# EAGLE design LRSN v1 (EAGLE 9.5.0)
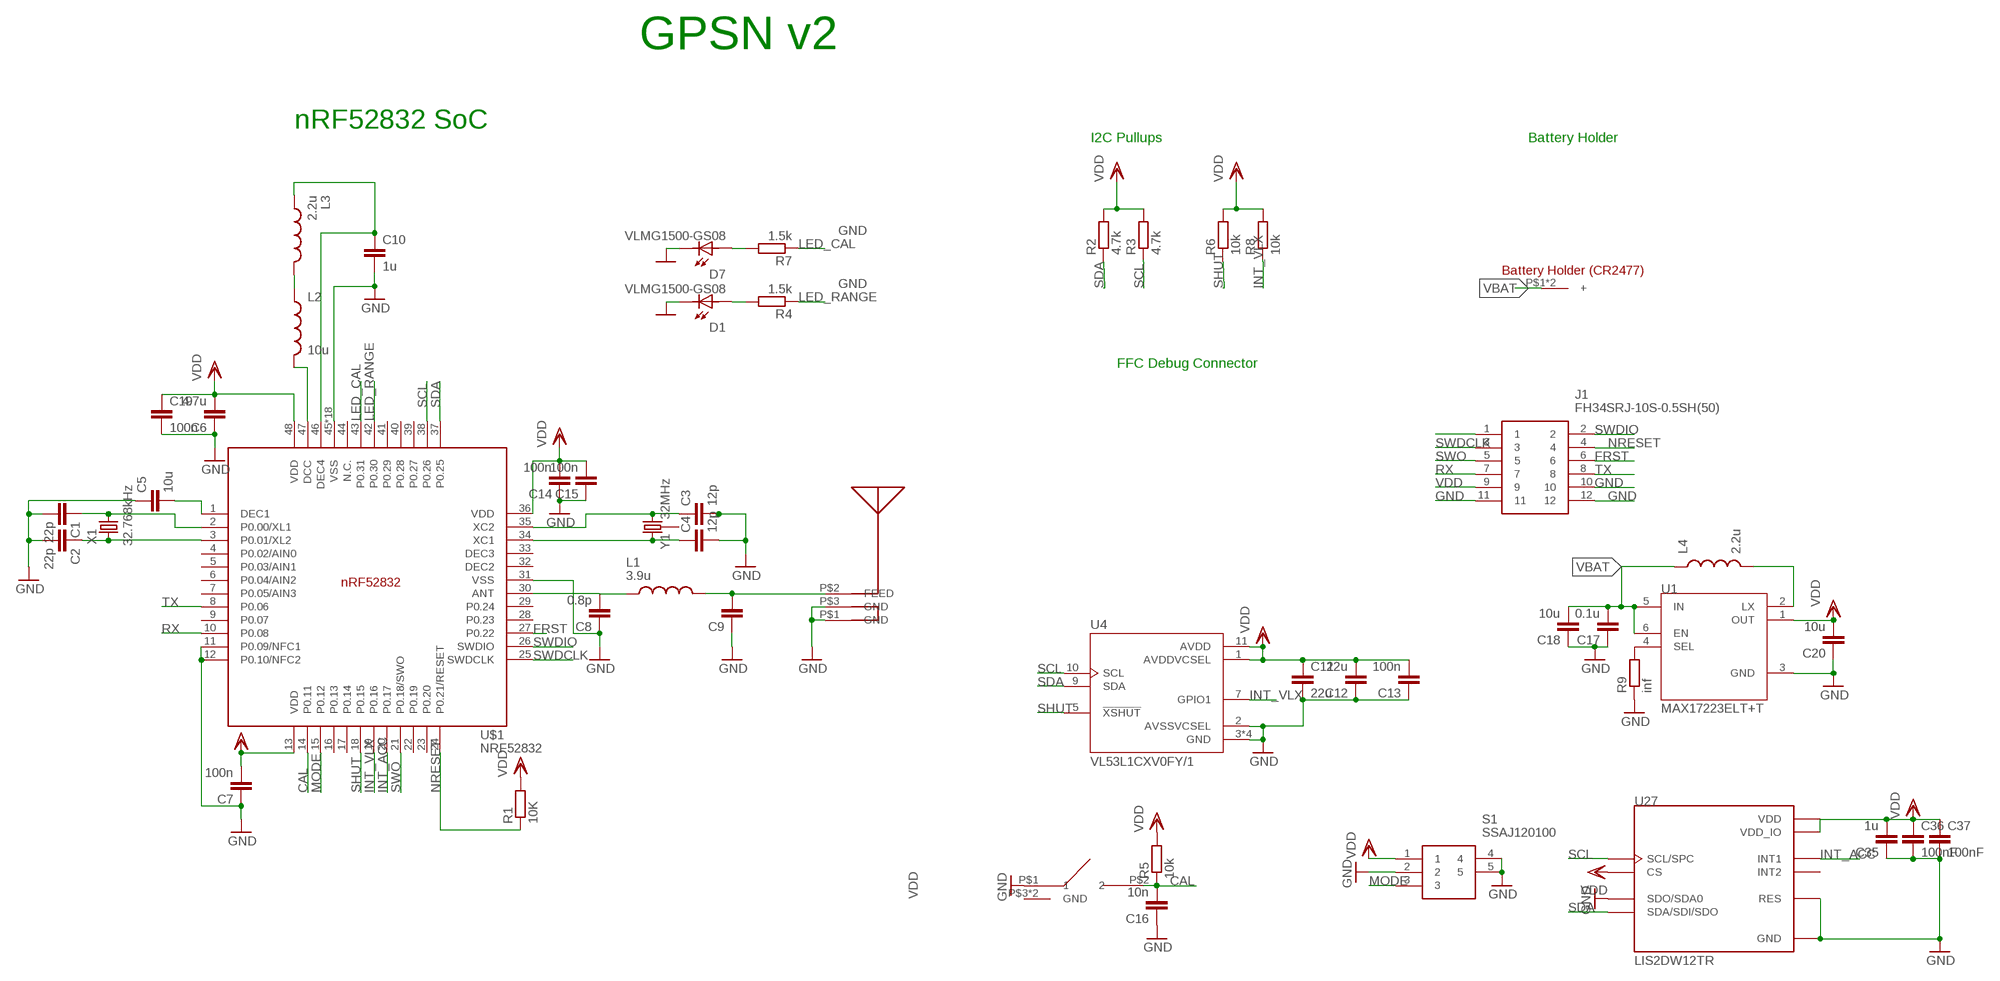
[diagram p0: schematic, sheet 1]

## Parts
C1  22p  CC0402  [C0402]
C2  22p  CC0402  [C0402]
C3  12p  CC0402  [C0402]
C4  12p  CC0402  [C0402]
C5  10u  CC0402  [C0402]
C6  4.7u  CC0402  [C0402]
C7  100n  CC0603R  [C0603R]
C8  0.8p  CC0402  [C0402]
C9  1.2p  CC0402  [C0402]
C10  1u  CC0402  [C0402]
C11  22u  CC0603R  [C0603R]
C12  22u  CC0603R  [C0603R]
C13  100n  CC0402  [C0402]
C14  100n  CC0402  [C0402]
C15  100n  CC0402  [C0402]
C16  10n  CC0402  [C0402]
C17  0.1u  CC0402  [C0402]
C18  10u  CC0402  [C0402]
C19  100n  CC0402  [C0402]
C20  10u  CC0402  [C0402]
C35  1u  CC0603R  [C0603R]
C36  100nF  CC0402  [C0402]
C37  100nF  CC0402  [C0402]
D1  VLMG1500-GS08  [LEDC1005X35N]
D7  VLMG1500-GS08  [LEDC1005X35N]
J1  FH34SRJ-10S-0.5SH(50)  [FH34SRJ10S05SH50]
L1  3.9u  MHQ0402P7N5JT000  [INDC0402X26N]
L2  10u  INDUCTOR  [L0603]
L3  2.2u  MHQ0402P7N5JT000  [INDC0402X26N]
L4  2.2u  INDUCTOR  [L0603]
R1  10K  RR0402  [R0402]
R2  4.7k  RR0402  [R0402]
R3  4.7k  RR0402  [R0402]
R4  1.5k  RR0402  [R0402]
R5  10k  RR0402  [R0402]
R6  10k  RR0402  [R0402]
R7  1.5k  RR0402  [R0402]
R8  10k  RR0402  [R0402]
R9  inf  RR0402  [R0402]
S1  SSAJ120100  [SSAJ120100]
U1  MAX17223ELT+T  [PSON65P200X200X80-6N]
U4  VL53L1CXV0FY/1  [SENSOR_VL53L1CXV0FY/1]
U27  LIS2DW12TR  [LGA12R50P4X4_200X200X70]
U$1  NRF52832  [QFN40P600X600X90-48_N]
U$3  T1C2QR  [T1C2QR]
U$4  CHIPANTENNAL2  [CHIPANTENNAL2]
VBAT  CR2477HOLDER  [CR2477HOLDER]
X1  32.768kHz  ABS07-32.768KHZ-T  [ABS07-32.768KHZ-T]
Y1  32MHz  CRYSTAL-26MHZSMD-3.2X2.5  [CRYSTAL-SMD-3.2X2.5MM]

## Nets
CAL: C16.2 R5.1 U$1.14(P0.11) U$3.P$2
FRST: J1.6 U$1.27(P0.22)
GND: C1.2 C2.2 C3.2 C4.2 C5.1 C6.1 C7.1 C8.1 C9.1 C10.2 C11.2 C12.1 C13.1 C14.1 C15.1 C16.1 C17.1 C18.1 C19.2 C20.1 C35.1 C36.2 C37.2 D1.2 D7.2 J1.10 J1.11 J1.12 R9.1 S1.2 S1.4 S1.5 U1.3(GND) U4.2(AVSSVCSEL) U4.3(GND) U4.4(GND) U4.6(GND) U4.12(GND) U27.3(SDO/SDA0) U27.6(GND) U27.7(RES) U27.8(GND) U$1.11(P0.09/NFC1) U$1.12(P0.10/NFC2) U$1.31(VSS) U$1.45(VSS) U$1.PAD(VSS) U$1.PAD@VIA01(VSS) U$1.PAD@VIA02(VSS) U$1.PAD@VIA03(VSS) U$1.PAD@VIA04(VSS) U$1.PAD@VIA05(VSS) U$1.PAD@VIA06(VSS) U$1.PAD@VIA07(VSS) U$1.PAD@VIA08(VSS) U$1.PAD@VIA09(VSS) U$1.PAD@VIA10(VSS) U$1.PAD@VIA11(VSS) U$1.PAD@VIA12(VSS) U$1.PAD@VIA13(VSS) U$1.PAD@VIA14(VSS) U$1.PAD@VIA15(VSS) U$1.PAD@VIA16(VSS) U$3.P$1 U$4.P$1(GND) U$4.P$3(GND)
INT_ACC: U27.12(INT1) U$1.20(P0.17)
INT_VLX: R8.1 U4.7(GPIO1) U$1.19(P0.16)
LED_CAL: R7.1 U$1.43(P0.31)
LED_RANGE: R4.1 U$1.42(P0.30)
MODE: S1.3 U$1.15(P0.12)
N$1: C1.1 U$1.2(P0.00/XL1) X1.2
N$2: C2.1 U$1.3(P0.01/XL2) X1.1
N$3: C3.1 U$1.35(XC2) Y1.3
N$4: C4.1 U$1.34(XC1) Y1.1
N$5: C5.2 U$1.1(DEC1)
N$6: C8.2 L1.1 U$1.30(ANT)
N$7: D1.1 R4.2
N$8: R9.2 U1.4(SEL)
N$9: L2.2 U$1.47(DCC)
N$10: L2.1 L3.2
N$11: C10.1 L3.1 U$1.46(DEC4)
N$13: L4.2 U1.2(LX)
N$17: J1.1
N$19: D7.1 R7.2
NRESET: J1.4 R1.1 U$1.24(P0.21/RESET)
RF: C9.2 L1.2 U$4.P$2(FEED)
RX: J1.7 U$1.10(P0.08)
SCL: R3.1 U4.10(SCL) U27.1(SCL/SPC) U$1.38(P0.26)
SDA: R2.1 U4.9(SDA) U27.4(SDA/SDI/SDO) U$1.37(P0.25)
SHUT: R6.1 U4.5(!XSHUT) U$1.18(P0.15)
SWDCLK: J1.3 U$1.25(SWDCLK)
SWDIO: J1.2 U$1.26(SWDIO)
SWO: J1.5 U$1.21(P0.18/SWO)
TX: J1.8 U$1.8(P0.06)
VBAT: C17.2 C18.2 L4.1 U1.5(IN) U1.6(EN) VBAT.P$1(+) VBAT.P$2(+)
VDD: C6.2 C7.2 C11.1 C12.2 C13.2 C14.2 C15.2 C19.1 C20.2 C35.2 C36.1 C37.1 J1.9 R1.2 R2.2 R3.2 R5.2 R6.2 R8.2 S1.1 U1.1(OUT) U4.1(AVDDVCSEL) U4.11(AVDD) U27.2(CS) U27.9(VDD) U27.10(VDD_IO) U$1.13(VDD) U$1.36(VDD) U$1.48(VDD)
Unconnected: U27.11(INT2) U$1.4(P0.02/AIN0) U$1.5(P0.03/AIN1) U$1.6(P0.04/AIN2) U$1.7(P0.05/AIN3) U$1.9(P0.07) U$1.16(P0.13) U$1.17(P0.14) U$1.22(P0.19) U$1.23(P0.20) U$1.28(P0.23) U$1.29(P0.24) U$1.32(DEC2) U$1.33(DEC3) U$1.39(P0.27) U$1.40(P0.28) U$1.41(P0.29) U$1.44(N.C.) U$3.P$3(GND) U$3.P$4(GND) Y1.2 Y1.4

## Notes on the sheet
- GPSN v2
- nRF52832 SoC
- I2C Pullups | Battery Holder
- FFC Debug Connector

## Library data of the parts
C1-C6 C8-C10 C13-C20 C36 C37 = eagle-ltspice:C: CAPACITOR, European symbol; SPICEMODEL: NONE; SPICEPREFIX: C
C7 C11 C12 C35 = eagle-ltspice:C: CAPACITOR, European symbol
D1 D7 = VLMG1500-GS08:VLMG1500-GS08: 0402 GREEN 571nm 35MCD 65° Rectangle with Flat Top SMT LED; AVAILABILITY: Unavailable; DESCRIPTION: 0402 GREEN 571nm 35MCD 65° Rectangle with Flat Top SMT LED; MF: Vishay; MP: VLMG1500-GS08; PACKAGE: 0402 Vishay; PRICE: None
J1 = FH34SRJ-10S-0.5SH_50_:FH34SRJ-10S-0.5SH(50): HIROSE(HRS) - FH34SRJ-10S-0.5SH(50) - CONNECTOR, FFC/FPC, RCPT, 10POS, 1ROW Source: Datasheet <https://www.hirose.com/product/en/products/FH34SRJ/FH34SRJ-10S-0.5SH(50)/> Check prices <https://pricing.snapeda.com/search/part/FH34SRJ-10S-0.5SH%2850%29/?ref=eda>; AVAILABILITY: Good; DESCRIPTION: FFC & FPC Connectors 10POS 0.50MM R/A CONN FFC FPC; MF: Hirose Connector; MP: FH34SRJ-10S-0.5SH(50); PACKAGE: None; PRICE: None; PURCHASE-URL: https://pricing.snapeda.com/search/part/FH34SRJ-10S-0.5SH(50)/?ref=eda
L1 L3 = MHQ0402P7N5JT000:MHQ0402P7N5JT000: 221 NH 5% GOLD TERMINAL; AVAILABILITY: Unavailable; DESCRIPTION: FIXED IND 7.5NH 200MA 1.2 OHM; MF: TDK; MP: MHQ0402P7N5JT000; PACKAGE: 0402 TDK; PRICE: None
L2 L4 = BeagleBone_Blue_R3:INDUCTOR: Inductors Basic Inductor/Choke - 0603 and 1206. Footprints are not proven and vary greatly between part numbers. SRN6045- 33uH, 20% 1.4A
R1-R9 = eagle-ltspice:R: RESISTOR, European symbol; SPICEMODEL: NONE; SPICEPREFIX: R
S1 = SSAJ120100:SSAJ120100: Slide Switches 1-pole 2-positions Surface Mount Slide Switch SPDT Maintained 10 mA Slide Source: Datasheet <https://componentsearchengine.com/Datasheets/1/SSAJ120100.pdf> Check prices <https://pricing.snapeda.com/search/part/SSAJ120100/?ref=eda>; AVAILABILITY: Good; DESCRIPTION: Switch Slide SPDT Raised Slide 0.01A 5VDC 10000Cycle Gull Wing SMD T/R; MF: ALPS; MP: SSAJ120100; PACKAGE: None; PRICE: None; PURCHASE-URL: https://pricing.snapeda.com/search/part/SSAJ120100/?ref=eda
U1 = MAX17223ELT_T:MAX17223ELT+T: Conv DC-DC Single Step Up 0.4V to 5.5V 6-Pin uDFN T/R Check prices <https://pricing.snapeda.com/parts/MAX17223ELT%2B/Maxim%20Integrated/view-part?ref=eda>; AVAILABILITY: Bad; DESCRIPTION: Boost Switching Regulator IC Positive Adjustable 1.8V 1 Output 500mA (Switch) 6-WDFN; MF: Maxim Integrated; MP: MAX17223ELT+; PACKAGE: uDFN-6 Maxim; PRICE: None
U4 = VL53L1:VL53L1CXV0FY/1: ToF Proximity 4m Distance Check prices <https://pricing.snapeda.com/search/part/VL53L1CXV0FY/1/?ref=eda>; AVAILABILITY: Good; DESCRIPTION: Optical Sensor 157.480 (4m) I²C Output; MF: STMicroelectronics; MP: VL53L1CXV0FY/1; PACKAGE: LGA-12 STMicroelectronics; PRICE: None; PURCHASE-URL: https://pricing.snapeda.com/search/part/VL53L1CXV0FY/1/?ref=eda
U27 = LIS2DW12TR:LIS2DW12TR: Mems Digital Output Motion Sensor Check prices <https://pricing.snapeda.com/parts/LIS2DW12TR/STMicroelectronics/view-part?ref=eda>; AVAILABILITY: Good; DESCRIPTION: Accelerometer X, Y, Z Axis ±2g, 4g, 8g, 16g 400Hz 12-LGA (2x2); MF: STMicroelectronics; MP: LIS2DW12TR; PACKAGE: LGA-12 STMicroelectronics; PRICE: None; PURCHASE-URL: https://pricing.snapeda.com/search/part/LIS2DW12TR/?ref=eda
U$1 = Nordic_nRF:NRF52832: nRF52832 Features Single chip, highly flexible, 2.4 GHz multi-protocol SoC 32-bit ARM Cortex-M4F Processor 1.7v to 3.6v operation 512kB flash + 64kB RAM Supports concurrent Bluetooth Smart/ANT protocol operation On-chip NFC tag for Out-of-Band (OOB) pairing Up to +4dBm output power -96dBm sensitivity, Bluetooth Smart Thread safe and run-time protected Event driven API On air compatible with nRF24L and nRF24AP series 2 data rates (2Mbps/1Mbps) PPI - maximum flexibility for power-efficient applications and code simplification Automated power management system with automatic power management of each peripheral Configurable I/O mapping for analog and digital I/O 3 x Master/Slave SPI 2 x Two-wire interface (I²C) UART (RTS/CTS) 3 x PWM AES HW encryption Real Time Counter (RTC) Digital microphone interface (PDM) On-chip balun Applications Internet of Things (IoT) Wearables SmartHome sensors Connected white goods Computer peripherals Voice-command smart remotes A4WP ‘Rezence’ wireless charging Beacons Sports and fitness sensors and hubs Connected health products Smart watches RC Toys Interactive games Building automation and sensor networks
U$3 = T1C2QR:T1C2QR
U$4 = CHIPANTENNA:CHIPANTENNAL2
VBAT = CR2477 holder:CR2477HOLDER
X1 = Crystals:ABS07-32.768KHZ-T: CRYSTAL 32.7680KHZ 12.5PF SMD Manufacturer's datasheet <https://abracon.com/Resonators/ABS07.pdf>; CREATED_BY: PCBLayout.com; DIGIKEY_PART_NUMBER: 535-9542-2-ND; MANUFACTURER: Abracon LLC; MPN: ABS07-32.768KHZ-T; PACKAGE: SMD-2
Y1 = SparkFun-Clocks:CRYSTAL-26MHZ: 26MHz Crystal w/ Ground Pin Digikey Example <http://www.digikey.com/product-detail/en/epson/TSX-3225%2026.0000MF09Z-AC3/SER3627CT-ND/1802878> Frequency: 26MHz Frequency Stability: ±9ppm Frequency Tolerance: ±10ppm Load Capacitance: 9pF SparkFun Products: SparkFun ESP32 Thing <https://www.sparkfun.com/products/13907> SparkFun ESP8266 Thing Dev Board <https://www.sparkfun.com/products/13711>; PROD_ID: XTAL-12454

## Board
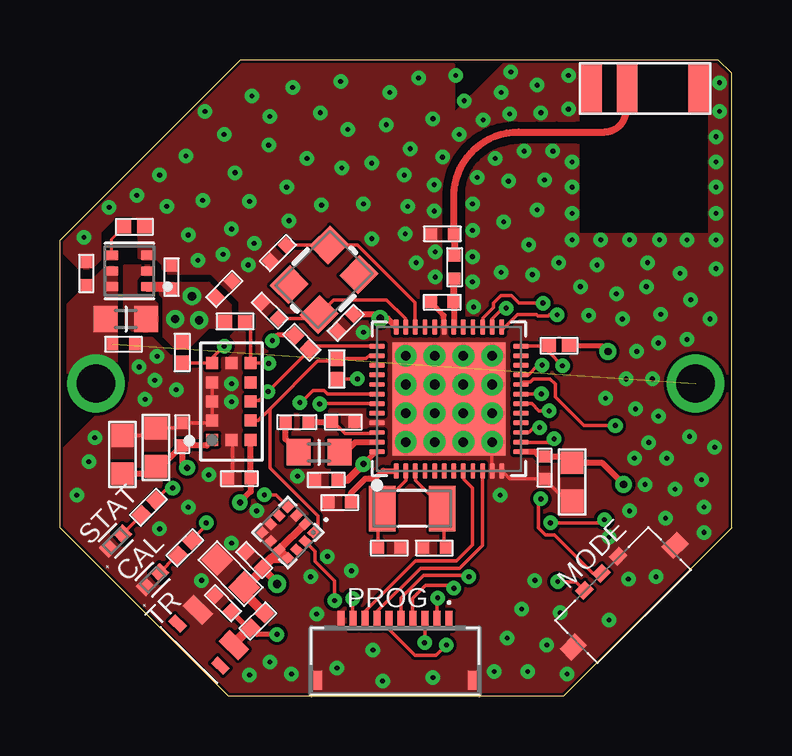
[diagram p1: board, top side]
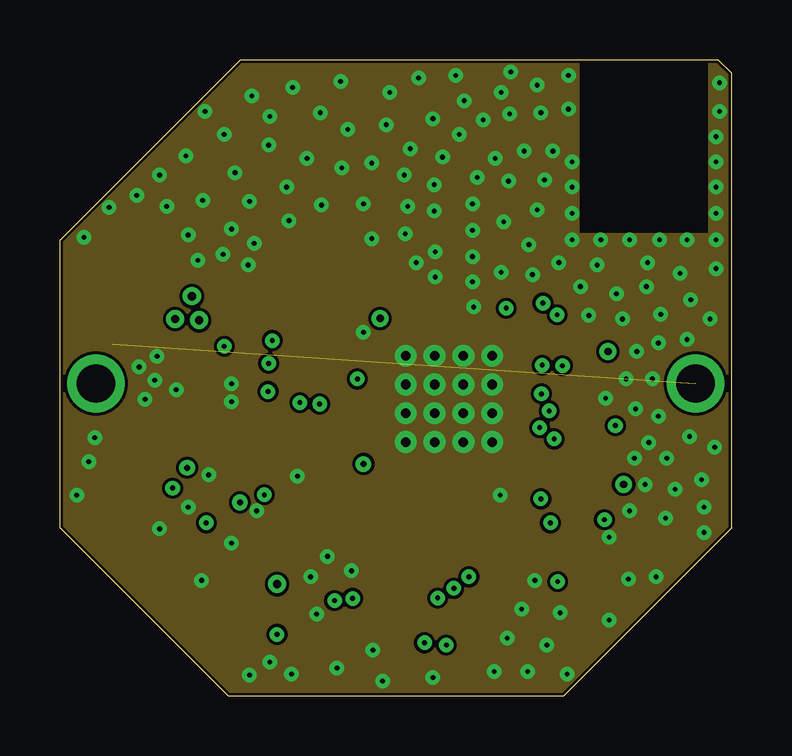
[diagram p2: board, inner layer Route2]
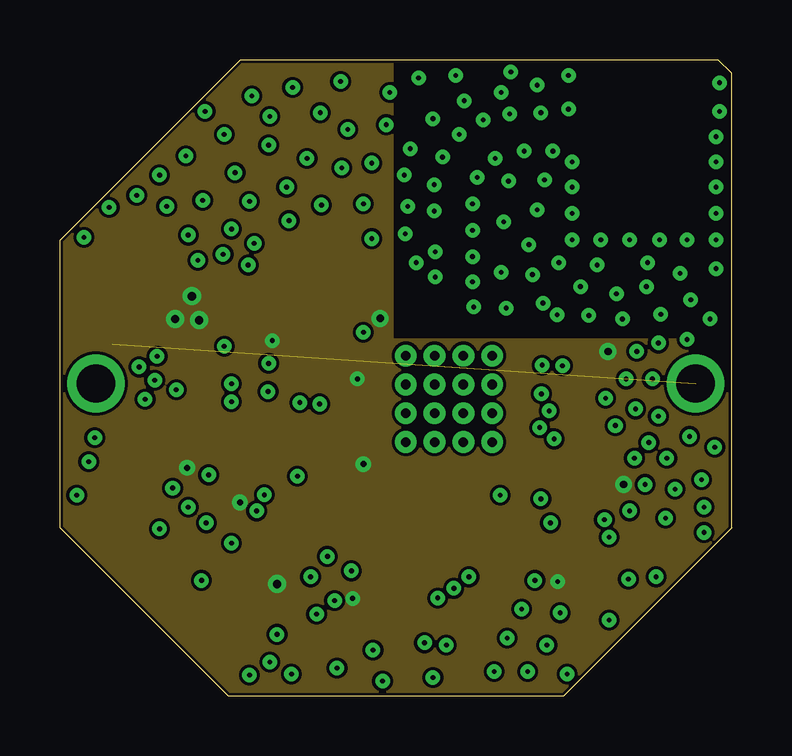
[diagram p3: board, inner layer Route15]
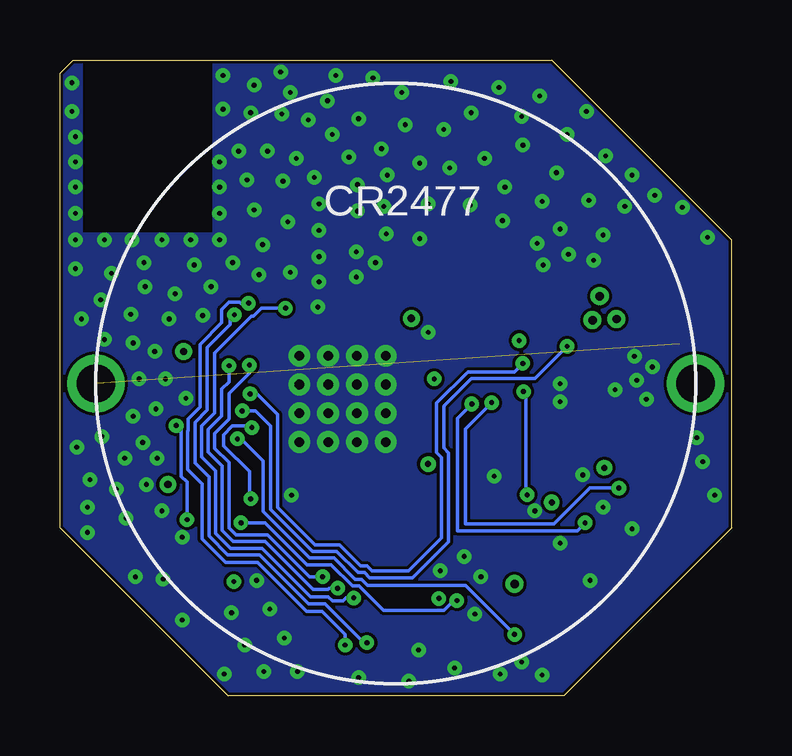
[diagram p4: board, bottom side, seen from below]

Size 28 x 26.5 mm. Coordinates in mm from the lower left corner, seen from the top.
Outline: 27.45,26.5 7.5,26.5 0,19 0,7 7,0 21,0 28,7 28,25.95 27.45,26.5
Copper layers (1+2*15+16): Top 0.035mm / dielectric 0.2mm / Route2 0.035mm / dielectric 0.46mm / Route15 0.035mm / dielectric 0.2mm / Bottom 0.035mm
Design rules "default *": minimum track width 5mil, minimum drill 0.2mm, track to track 5mil, track to pad 5mil, pad to pad 5mil, via to via 5mil, smd to smd 5mil, copper to edge 5mil, drill to drill 6mil, minimum pad ring 10mil, minimum via ring 8mil, stop-mask expansion 0mil, vias tented up to drill 40mil, thermal gap 0mil
tRestrict: area 15,15.9 to 16,16.9; 7 lines

### Footprints (pad centres in the part's own frame; a part is rotated, then mirrored left to right if it is on the bottom)
C0402 = smd 0.5 x 0.5: 1 -0.475,0; 2 0.475,0
C0603R = smd 0.95 x 0.95: 1 -0.85,0; 2 0.75,0
LEDC1005X35N = smd 0.59 x 0.61: 1 -0.415,0; 2 0.415,0
FH34SRJ10S05SH50 = smd 0.3 x 0.8: 1 2.25,1.55; 2 1.75,1.55; 3 1.25,1.55; 4 0.75,1.55; 5 0.25,1.55; 6 -0.25,1.55; 7 -0.75,1.55; 8 -1.25,1.55; 9 -1.75,1.55; 10 -2.25,1.55 | smd 0.4 x 0.8: 11 -3.25,-0.95; 12 3.25,-0.95
INDC0402X26N = smd 0.5 x 0.5: 1 -0.732,0; 2 0.232,0
L0603 = smd 1 x 1.1: 1 -0.85,0; 2 0.85,0
R0402 = smd 0.6 x 0.55: 1 -0.425,0; 2 0.425,0
SSAJ120100 = smd 0.6 x 0.51: 1 0,0; 2 2,0; 3 1,0 | smd 0.9 x 0.7: 4 -2,-1.355; 5 4,-1.355
PSON65P200X200X80-6N = smd 0.55 x 0.4: 1 -0.75,0.65; 2 -0.75,0; 3 -0.75,-0.65; 4 0.75,-0.65; 5 0.75,0; 6 0.75,0.65
SENSOR_VL53L1CXV0FY/1 = smd 0.5 x 0.5: 1 0.8,1.6; 2 0.8,0.8; 3 0.8,0; 4 0.8,-0.8; 5 0.8,-1.6; 6 0,-1.6; 7 -0.8,-1.6; 8 -0.8,-0.8; 9 -0.8,0; 10 -0.8,0.8; 11 -0.8,1.6; 12 0,1.6
LGA12R50P4X4_200X200X70 = smd 0.4 x 0.35: 1 -0.76,0.75; 2 -0.76,0.25; 3 -0.76,-0.25; 4 -0.76,-0.75; 7 0.76,-0.75; 8 0.76,-0.25; 9 0.76,0.25; 10 0.76,0.75 | smd 0.35 x 0.4: 5 -0.25,-0.76; 6 0.25,-0.76; 11 0.25,0.76; 12 -0.25,0.76
QFN40P600X600X90-48_N = smd 0.65 x 0.2: 1 -3,2.2; 2 -3,1.8; 3 -3,1.4; 4 -3,1; 5 -3,0.6; 6 -3,0.2; 7 -3,-0.2; 8 -3,-0.6; 9 -3,-1; 10 -3,-1.4; 11 -3,-1.8; 12 -3,-2.2; 25 3,-2.2; 26 3,-1.8; 27 3,-1.4; 28 3,-1; 29 3,-0.6; 30 3,-0.2; 31 3,0.2; 32 3,0.6; 33 3,1; 34 3,1.4; 35 3,1.8; 36 3,2.2 | smd 0.2 x 0.65: 13 -2.2,-3; 14 -1.8,-3; 15 -1.4,-3; 16 -1,-3; 17 -0.6,-3; 18 -0.2,-3; 19 0.2,-3; 20 0.6,-3; 21 1,-3; 22 1.4,-3; 23 1.8,-3; 24 2.2,-3; 37 2.2,3; 38 1.8,3; 39 1.4,3; 40 1,3; 41 0.6,3; 42 0.2,3; 43 -0.2,3; 44 -0.6,3; 45 -1,3; 46 -1.4,3; 47 -1.8,3; 48 -2.2,3 | smd 4.7 x 4.7: PAD 0,0 | drill 0.4: PAD@VIA01 -1.8,1.8; PAD@VIA02 -1.8,0.6; PAD@VIA03 -1.8,-0.6; PAD@VIA04 -1.8,-1.8; PAD@VIA05 -0.6,1.8; PAD@VIA06 -0.6,0.6; PAD@VIA07 -0.6,-0.6; PAD@VIA08 -0.6,-1.8; PAD@VIA09 0.6,1.8; PAD@VIA10 0.6,0.6; PAD@VIA11 0.6,-0.6; PAD@VIA12 0.6,-1.8; PAD@VIA13 1.8,1.8; PAD@VIA14 1.8,0.6; PAD@VIA15 1.8,-0.6; PAD@VIA16 1.8,-1.8
T1C2QR = smd 1.14 x 0.65: P$1 0.6,0.3; P$2 2.7,0.3 | smd 0.7 x 0.4: P$3 0.4,-0.7; P$4 2.9,-0.7
CHIPANTENNAL2 = smd 0.85 x 2: P$1 0.45,1; P$2 1.925,1; P$3 4.9,1
CR2477HOLDER = drill 1.6: P$1 0,0; P$2 25,0
ABS07-32.768KHZ-T = smd 1.1 x 1.9: 1 -1.25,0; 2 1.25,0
CRYSTAL-SMD-3.2X2.5MM = smd 1.2 x 1.1: 1 -1.175,-0.875; 2 1.175,-0.875; 3 1.175,0.875; 4 -1.175,0.875

### Placement (x,y rotation side)
C1  13.73,6.15 0 top
C2  15.61,6.15 180 top
C3  8.75,16.05 135 top
C4  9.09,18.45 225 top
C5  11.67,8.05 0 top
C6  7.48,9.05 0 top
C7  21.35,8.96 90 top
C8  15.94,16.4 0 top
C9  15.95,19.25 0 top
C10  11.81,11.4 0 top
C11  2.6,10.1 90 top
C12  4,10.3 270 top
C13  5.1,10.9 270 top
C14  11.1,8.99 0 top
C15  20.2,9.5 90 top
C16  6.8,3.85 315 top
C17  1.1,17.6 270 top
C18  2.65,14.65 180 top
C19  11.91,15.54 225 top
C20  4.65,17.45 270 top
C35  7.15,5.05 315 top
C36  6.85,16.95 45 top
C37  8.1,5.65 135 top
D1  2.32,6.44 225 top
D7  3.86,4.83 225 top
J1  13.97,1.58 0 top
L1  16.45,18.11 90 top
L2  10.8,10.14 0 top
L3  9.63,11.4 180 top
L4  2.75,15.7 0 top
R1  20.81,14.59 0 top
R2  10.09,14.73 135 top
R3  11.54,13.62 270 top
R4  3.69,7.85 225 top
R5  8.25,3.11 45 top
R6  5.1,14.3 90 top
R7  5.21,6.16 225 top
R8  7.3,15.6 180 top
R9  3.1,19.55 180 top
S1  21.86,4.39 45 top
U1  2.9,17.7 180 top
U4  7.15,12.26 180 top
U27  9.5,6.8 225 top
U$1  16.22,12.37 90 top
U$3  5.11,3.78 315.5 top
U$4  21.72,24.32 0 top
VBAT  1.5,13.01 0 top
X1  14.69,7.8 180 top
Y1  11.01,17.34 225 top

### Tracks (layer width: path | path; a pad name or v marks a point on that pad's centre or on a via)
CAL  (via drill 0.2, 0.2 pad 0.45)
  Top 0.15: U$1.14 19.25,10.54 19.52,10.54 19.53,10.55 20.45,10.55 v20.6,10.7 | 7.89,2.81 R5.1
  Top 0.203: v9.05,2.55 8.21,2.55 R5.1 7.84,2.81 C16.2
  Top 0.406: U$3.P$2 7.25,2.17 7.89,2.81
  Bottom 0.15: v9.05,2.55 11.1,4.6 15.17,4.6 15.43,4.85 15.7,4.85 16.58,5.73 17.59,5.73 19.53,7.67 19.53,9.78 20.45,10.7 v20.6,10.7
FRST  (via drill 0.2)
  Top 0.15: J1.6 13.69,3.1 13.69,2.79 14.81,1.67 15.68,1.67 v16.11,2.1 | U$1.27 17.64,15.39 17.64,15.75 18.07,16.18 18.07,16.37 18.38,16.68 18.82,16.68 19.14,16.36 v20.14,16.36
  Bottom 0.15: v20.14,16.36 v20.15,16.35 20.45,16.35 20.51,16.41 20.95,16.41 21.26,16.09 21.26,15.54 22.16,14.64 22.16,12.03 22.65,11.54 22.65,11.05 22.67,11.03 22.67,9.42 22.06,8.81 22.06,6.53 21.09,5.56 19.77,5.56 17.72,3.51 17.07,3.51 16.11,2.55 v16.11,2.1
GND  (via drill 0.2)
  Top 0.15: U4.12 7.21,10.61 7.21,9.25 C6.1 | C11.2 3.7,10.85 C12.1 4.88,11.15 C13.1 6.26,11.38 U4.2 U4.3 U4.4 | C7.1 21.12,8.11 C15.1 18.77,9.03 U$1.12 U$1.11 U$1.PAD@VIA04 | U$1.PAD@VIA04 18.02,11.02 18.1,11.1 18.1,10.65 U$1.PAD@VIA04
  Top 0.203: U$1.31 16.02,15.85 C8.1
  other vias: 16.5,25.85 12,23.6 19.9,25.45 16.85,24.8 18.4,17.65 13.75,25.15 18.5,19.75 20.55,22.7 17.4,21.6 19.55,18.8 27.35,19 27.35,22.25 21.2,25.85 18.15,22.4 27.35,23.3 27.35,21.2 3.2,20.85 14.95,25.75 20.05,24.3 27.5,25.55 18.75,24.25 18.4,25.15 27.35,20.1 27.5,24.35 15.55,24.05 6.05,24.35 18.8,26 7.15,19.45 7.85,17.95 11.7,25.6 17.65,24 16.65,23.4 14.35,21.7 22.4,17.95 27.1,15.7 15.65,18.5 14.4,19.25 23.45,15.7 19.7,17.55 21.2,24.45 17.2,18.3 21.7,17.05 25,19 15.6,21.3 19.35,22.7 24.45,17.05 23.75,19 22.55,19 18.7,21.45 14.85,18.05 17.2,19.4 17.2,20.5 17.2,17.25 14.5,20.4 26.15,19 15.6,20.2 25.85,17.6 13,22.2 20.2,21.5 19.9,20.25 15.65,17.45 20.8,18.05 17.25,16.2 15.95,22.45 20.85,3.45 24.85,4.95 23.75,7.7 26.85,7.85 7.15,13 8.7,22.95 24.4,8.8 9.7,25.35 20.3,2.1 22.9,6.6 10.85,24.3 8,25 6.85,23.4 7.15,6.35 12.65,20.5 10.3,22.4 19.8,4.8 23.7,4.85 7.9,20.6 18.1,1 18.65,2.4 26.85,6.8 9.55,19.8 5.25,22.5 11.55,1.15 19.5,1 19.25,3.6 15.55,0.75 21.15,0.9 22.9,3.15 25.25,7.4 5.35,7.85 26.75,9 25.65,8.6 22.05,15.85 26.15,14.85 4.45,20.4 25.3,9.9 13.6,23.8 24.05,14.35 4.15,21.7 3.3,13.7 13,19.05 27.35,17.8 24.5,18.05 10.9,20.45 26.3,16.5 23.2,16.75 24.7,13.2 9.9,9.15 6.2,9.2 8.75,24.15 7.3,21.8 24.95,14.7 25.05,15.9 14.6,22.8 8.1,18.85 27.3,10.35 24.55,10.55 2.05,20.35 11.75,22 26.25,10.8 9.45,21.2 5.95,20.65 4.05,14.15 5.75,18.15 1.2,9.75 8.2,7.7 1.45,10.75 22.75,12.4 4.85,12.75 3.55,12.35 7.15,12.25 18.35,8.35 11.15,5.8 24.95,11.65 1,19.1 6.8,18.4 5.35,19.2 12.65,15.15 24,11.95 3.95,13.15 0.7,8.35 10.7,3.4 13.05,1.9 7.9,0.85 10.45,4.95 13.45,0.6 12.15,5.2 4.15,6.95 23.6,13.2 23.95,9.9 8.75,1.4 5.9,4.8 9.65,0.9 21.35,19 21.35,22.25 21.35,21.2 21.35,20.1
  pour Top: 7.15,-0.2 0.05,6.9 0.05,7.9 18.65,26.5 21.6,26.5 21.6,19.25 27.1,19.25 27.1,26.45 28.05,26.45 28.05,6.9 20.95,-0.2
  pour Bottom: 7.15,-0.15 0.05,6.95 0.05,19.1 7.5,26.55 21.6,26.55 21.6,19.25 27.1,19.25 27.1,26.5 28.05,26.5 28.05,6.95 20.95,-0.15
  pour Route2: 7.15,-0.15 0.05,6.95 0.05,19.1 7.5,26.55 21.6,26.55 21.6,19.25 27.1,19.25 27.1,26.5 28.05,26.5 28.05,6.95 20.95,-0.15
  pour Top: 26.85,24.4 26.85,26.2 27.25,26.2 27.25,24.4
  pour Top: 21.5,24.4 21.5,26.2 21.9,26.2 21.9,24.4
  pour Top: 7.5,15.1 7.5,26.4 7.6,26.5 16.2,26.5 16.4,26.3 16.4,23.85 7.65,15.1
  pour Top: 7.5,16.4 6.3,17.6 4.5,17.6 4.3,17.8 4.3,17.95 4.05,18.2 3.35,18.2 3.3,18.25 3.3,19.85 3.15,20 2.35,20 1.65,19.3 1.65,18.15 1.3,17.8 0.8,17.8 0.05,18.55 0.05,18.95 7.5,26.4 7.7,26.4 7.7,16.6
  pour Top: 2.95,13.75 2.95,14.9 3.85,14.9 4.6,14.15 5.5,14.15 5.9,14.55 6.4,15.05 6.8,15.05 7.45,14.4 7.45,14.05 4.55,11.15 4.15,11.15 0.95,7.95 0,7.95 0,10.15 0.95,11.1 2.95,13.1
INT_ACC  (via drill 0.2)
  Top 0.15: U27.12 10.64,6.01 10.64,5.59 11.45,4.79 v11.45,3.96 11.45,3.9 | v20.45,7.2 22.47,7.2 22.6,7.33 v22.7,7.33 | U$1.20 19.32,13.07 19.61,13.07 19.74,13.2 20.44,13.2 20.65,12.99 20.65,12.45 21.84,11.26 v23.16,11.26
  Bottom 0.15: v11.45,3.96 11.57,3.96 11.99,3.54 14.51,3.54 15.54,4.58 15.81,4.58 16.69,5.46 17.7,5.46 19.45,7.2 v20.45,7.2 | v22.7,7.33 22.7,8.9 22.95,9.14 22.95,11.1 23.11,11.26 v23.16,11.26
INT_VLX  (via drill 0.2)
  Top 0.15: R8.1 7.88,15.44 7.95,15.51 U4.7 v8.69,13.86 v8.7,13.85 | U$1.19 v20.07,12.58
  Bottom 0.15: v8.7,13.85 9.05,13.5 11,13.5 12.3,12.19 12.3,10.14 12.09,9.93 12.09,6.58 13.47,5.21 15,5.21 15.2,5.41 15.47,5.41 16.35,6.29 17.36,6.29 18.92,7.84 18.92,11.72 19.77,12.58 v20.07,12.58
LED_CAL  (via drill 0.2)
  Top 0.127: R7.1 5.51,6.51 6.1,7.1
  Top 0.15: U$1.43 v10.84,12.17 v10.82,12.16 | R7.1 5.51,6.51 6.1,7.1 v6.1,7.2
  Bottom 0.15: 6.15,7.2 v6.1,7.2 6.43,6.87 11.43,6.87 11.43,11.56 v10.82,12.16
LED_RANGE  (via drill 0.2)
  Top 0.127: R4.1 | R4.1 4.32,8.48
  Top 0.15: v10,12.21 10.05,12.21 10.55,12.71 11.02,12.71 11.16,12.57 U$1.42 | R4.1 4.32,8.48 4.49,8.65 v4.7,8.65
  Bottom 0.15: v4.7,8.65 5.9,8.65 7.4,7.15 11.1,7.15 11.1,11.11 v10,12.21
MODE  (via drill 0.2)
  Top 0.15: S1.3 22.22,5.1 20.62,6.7 20.24,6.7 19.95,6.99 19.95,8.1 v20.05,8.2 | U$1.15 19.24,10.99 19.57,10.99 19.75,11.17 v20,11.17
  Bottom 0.15: v20,11.17 v20,11.18 20.05,11.23 20.82,11.23 21.18,10.87 21.18,10.42 20.1,9.34 20.1,8.25 v20.05,8.2
N$1
  Top 0.15: U$1.2 14.42,8.97 13.44,7.99 X1.2 13.25,7.62 C1.1
N$2
  Top 0.15: C2.1 16,6.24 16,7 X1.1 15.94,7.85 14.82,8.97 U$1.3
N$3
  Top 0.15: C3.1 10.62,15.71 Y1.3 11.41,16.5 13.62,16.5 14.4,15.72 14.4,15.39 U$1.35
N$4
  Top 0.15: C4.1 Y1.1 | Y1.1 | U$1.34 14.8,15.39 14.8,16.38 12.4,18.79 Y1.1
N$5
  Top 0.15: 14,9.37 U$1.1
  Top 0.254: C5.2 12.14,8.45 12.74,9.04 13.15,9.04 13.48,9.37 14,9.37
N$6
  Top 0.254: 16.42,16.43 U$1.30
  Top 0.3: 16.44,17.36 L1.1 16.41,17.34 C8.2 16.42,16.43
N$7
  Top 0.127: D1.1 2.61,6.77
  Top 0.15: 3.39,7.51 R4.2 3.39,7.51 | D1.1 | D1.1 3.37,7.49 3.39,7.51 | 3.39,7.51
N$8
  Top 0.127: U1.4 2.15,19.02 R9.2
N$9
  Top 0.254: L2.2 11.89,10.14 12.32,10.57 12.78,10.57 U$1.47
N$10
  Top 0.254: L2.1 9.4,10.69 L3.2
N$11
  Top 0.15: L3.1 C10.1 11.4,11.4 11.88,10.92 12.17,10.92 12.63,10.92 13.17,10.92 U$1.46
  Top 0.254: L3.1 11.4,11.4
N$13
  pour Top: 3.05,15.2 2.75,15.5 2.75,16 2.7,16.05 2.7,17.9 3.85,17.9 3.85,17.55 3.35,17.55 3.15,17.35 3.15,16.7 3.3,16.55 3.8,16.55 4.05,16.3 4.05,15.2
N$19
  Top 0.127: R7.2 4.85,5.8 4.73,5.68 4.71,5.68 | 4.17,5.12 D7.1
  Top 0.15: R7.2 4.89,5.86 4.71,5.68 | D7.1 4.83,5.8 4.85,5.8
NRESET  (via drill 0.2)
  Top 0.15: U$1.24 20.37,14.57 R1.1 20.38,14.31 v20.95,13.75 | v16.42,4.47 16.29,4.6 15.23,4.6 14.69,4.06 14.69,3.16 J1.4
  Bottom 0.15: v20.95,13.75 20.95,13.08 21.26,12.77 21.26,11.65 21.82,11.09 21.82,10.15 21.23,9.56 21.23,6.88 20.77,6.42 19.45,6.42 17.45,4.42 16.83,4.42 16.78,4.47 v16.42,4.47
RF
  Top 0.3: L1.2 16.45,19.23 C9.2 16.43,20.81 arc-90 19.12,23.5 22.7,23.5 arc90 23.6,24.4 23.6,25.27 | 23.6,25.27 arc-90 U$4.P$2 arc90 23.6,25.27
RX
  Top 0.15: J1.7 13.22,3.5 15.02,5.3 16.65,5.3 17.62,6.27 U$1.10
SCL
  Top 0.15: U$1.38 13.19,14.2 12.92,14.2 12.77,14.04 R3.1 11.44,13.95 10.75,13.95 8.75,11.95 | U4.10 8.26,11.46 8.75,11.95 | U27.1 10.75,6.99 10.75,7.5 8.75,9.5 8.75,11.95
SDA  (via drill 0.2)
  Top 0.15: U4.9 7.99,12.3 8.3,12.3 v8.68,12.68 10.41,14.41 R2.1 10.53,14.57 U$1.37 | U27.4 9.02,8.37 v8.52,8.37
  Bottom 0.15: v8.52,8.37 8.57,8.43 8.57,12.57 v8.68,12.68
SHUT  (via drill 0.2)
  Top 0.15: R6.1 5.12,13.86 U4.5 6.35,14.07 v6.85,14.57 | v20.4,11.87 19.97,11.87 19.67,12.17 U$1.18
  Bottom 0.15: v6.85,14.57 8.2,13.22 10.85,13.22 12,12.06 12,10.31 11.79,10.11 11.79,6.41 13.3,4.9 15.09,4.9 15.31,5.13 15.58,5.13 16.46,6.01 17.48,6.01 19.22,7.75 19.22,11.24 19.84,11.87 v20.4,11.87
SWDCLK  (via drill 0.2)
  Top 0.15: J1.3 15.22,2.22 v15.2,2.2 | U$1.25 18.49,15.29 19.07,15.88 19.87,15.88 19.92,15.83 20.36,15.83 20.4,15.88 v20.73,15.88
  Bottom 0.15: v15.2,2.2 15.33,2.2 16.94,3.81 17.63,3.81 19.68,5.86 21,5.86 21.79,6.65 21.79,9.11 22.37,9.7 22.37,11.39 21.86,11.9 21.86,14.51 20.9,15.47 20.9,15.7 v20.73,15.88
SWDIO  (via drill 0.2)
  Top 0.15: J1.2 15.72,4.04 v15.75,4.07 | v18.6,16.15 18.47,16.15 18.02,15.7 U$1.26
  Bottom 0.15: v15.75,4.07 16.07,4.07 16.2,3.94 16.64,3.94 16.82,4.12 17.54,4.12 19.57,6.14 20.89,6.14 21.51,6.76 21.51,9.37 22.1,9.95 22.1,11.24 21.56,11.78 21.56,14.29 20.02,15.83 19.92,15.83 19.6,16.15 v18.6,16.15
SWO  (via drill 0.2)
  Top 0.15: v17.05,4.95 17,5 15.15,5 14.22,4.07 J1.5 | U$1.21 19.52,13.37 19.93,13.78 v20.1,13.78
  Bottom 0.15: v20.1,13.78 20.1,13.45 20.95,12.6 20.95,11.53 21.54,10.94 21.54,10.3 20.95,9.72 20.95,6.99 20.66,6.7 19.34,6.7 17.59,4.95 v17.05,4.95
TX
  Top 0.15: J1.8 12.74,3.15 12.74,3.52 14.82,5.61 16.53,5.61 17.2,6.28 17.2,8.66 16.84,9.02 16.84,9.35 U$1.8
VBAT  (1 unrouted)
  pour Top: 0.35,12.9 0.35,16.3 1.9,17.85 2.35,17.85 2.35,13.55 1.7,12.9
VDD  (via drill 0.2, 0.25, 0.3, 0.35)
  Top 0.15: C13.2 4.22,9.55 C12.2 3.88,9.43 3.7,9.25 | 2.85,9.25 C11.1 | 21.11,9.96 C7.2 | R3.2 v12.39,13.2 v12.4,13.2 | S1.1 21.5,4.75 v20.75,4.75 | J1.9 12.2,3.15 v12.2,4.05
  Top 0.2: R1.2 22.61,14.59 v22.85,14.35 | R2.2 9.08,15.03 v8.85,14.8
  Top 0.203: v12.65,9.65 13.17,10.17 U$1.48
  Top 0.254: U$1.13 19.8,10.17 19.99,9.97 C15.2 21.09,9.97 21.11,9.96 | U4.1 6.12,10.43 C13.2 | C13.2 4.1,9.43 3.88,9.43 | C12.2 3.7,9.25 2.85,9.25 | U4.11 C6.2 7.96,8.51 v7.5,8.05 | U$1.36 13.66,15.73 v13.35,15.73 13.2,15.88 C19.1 | C13.2 5.1,9.7 v5.3,9.5 | C7.2 22.59,9.71 v23.5,8.8
  Top 0.305: U27.2 U27.9 U27.10 | C14.2 11.99,8.99 v12.65,9.65 | C37.1 9.05,4.7 v9.05,4.65
  Top 0.406: U1.1 4.58,17.05 C20.2 | 8.89,5.73 U27.10 | 9.14,5.98 8.89,5.73 | 8.89,5.73 8.85,5.73 C37.1 8.44,5.22 7.73,4.52 C35.2 7.68,4.28 R5.2
  other vias: 5.5,16.65 4.8,15.7 5.8,15.65
  pour Route15: 7.15,-0.15 0.05,6.95 0.05,19.1 7.5,26.55 13.85,26.55 13.85,14.85 27.1,14.85 27.1,26.5 28.05,26.5 28.05,6.95 20.95,-0.15
  pour Top: 4.8,14.5 4.35,14.95 4.35,16.55 4.2,16.7 4.2,17.2 6.2,17.2 7.1,16.3 7.1,15.35 6.2,15.35 5.35,14.5

### Text on the board
tPlace: STAT | CAL | TR | PROG | MODE
bPlace: CR2477